# Altium schematic sheet Stepper_motodriver.SchDoc
size A4; SheetNumber: 3; SheetTotal: 22
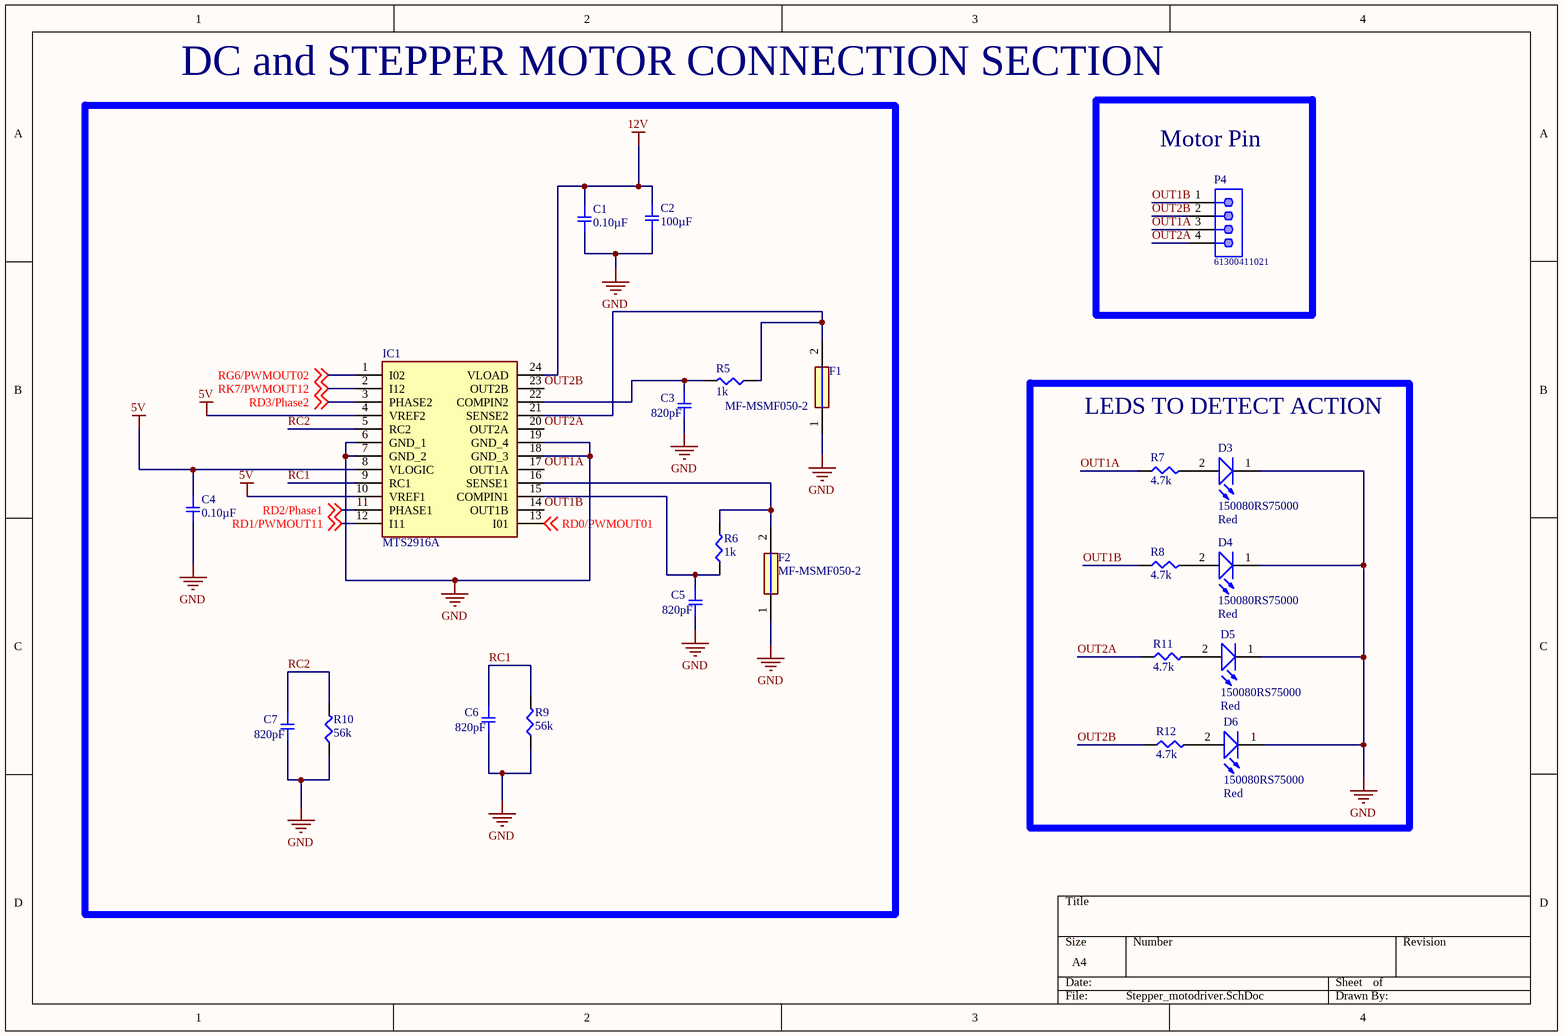
[diagram p0: Stepper_motodriver.SchDoc]

## Parts
C1  0.10µF  [SMD-0805C]
C2  100µF  [SMD-0805C]
C3  820pF  [SMD-0805C]
C4  0.10µF  [SMD-0805C]
C5  820pF  [SMD-0805C]
C6  820pF  [SMD-0805C]
C7  820pF  [SMD-0805C]
D3  150080RS75000  Emitting Color: Red  [WL-SMCW_0805]
D4  150080RS75000  Emitting Color: Red  [WL-SMCW_0805]
D5  150080RS75000  Emitting Color: Red  [WL-SMCW_0805]
D6  150080RS75000  Emitting Color: Red  [WL-SMCW_0805]
F1  MF-MSMF050-2  [FUSC4632X85N]
F2  MF-MSMF050-2  [FUSC4632X85N]
IC1  MTS2916A  [SOIC127P1046X264-24N]
P4  61300411021  [61300411021]
R5  1k  [SMD-0805-RES]
R6  1k  [SMD-0805-RES]
R7  4.7k  [SMD-0805-RES]
R8  4.7k  [SMD-0805-RES]
R9  56k  [SMD-0805-RES]
R10  56k  [SMD-0805-RES]
R11  4.7k  [SMD-0805-RES]
R12  4.7k  [SMD-0805-RES]

## Blocks framed on the sheet
DC and STEPPER MOTOR CONNECTION SECTION: C1-C7 F1 F2 IC1 R5 R6 R9 R10
Motor Pin: P4
LEDS TO DETECT ACTION: D3-D6 R7 R8 R11 R12

## Nets
5V: C4.1 IC1.4(VREF2) IC1.8(VLOGIC) IC1.10(VREF1)
12V: C1.1 C2.1 IC1.24(VLOAD)
GND: C1.2 C2.2 C3.2 C4.2 C5.2 C6.2 C7.2 D3.1(K) D4.1(K) D5.1(K) D6.1(K) F1.1 F2.1 IC1.6(GND_1) IC1.7(GND_2) IC1.18(GND_3) IC1.19(GND_4) R9.1 R10.1
OUT1A: IC1.17(OUT1A) P4.3 R7.1
OUT1B: IC1.14(OUT1B) P4.1 R8.1
OUT2A: IC1.20(OUT2A) P4.4 R11.1
OUT2B: IC1.23(OUT2B) P4.2 R12.1
RC1: C6.1 IC1.9(RC1) R9.2
RC2: C7.1 IC1.5(RC2) R10.2
RD0/PWMOUT01: IC1.13(I01) ; off-sheet RD0/PWMOUT01
RD1/PWMOUT11: IC1.12(I11) ; off-sheet RD1/PWMOUT11
RD2/Phase1: IC1.11(PHASE1) ; off-sheet RD2/Phase1
RD3/Phase2: IC1.3(PHASE2) ; off-sheet RD3/Phase2
RG6/PWMOUT02: IC1.1(I02) ; off-sheet RG6/PWMOUT02
RK7/PWMOUT12: IC1.2(I12) ; off-sheet RK7/PWMOUT12
NetC3_1: C3.1 IC1.22(COMPIN2) R5.2
NetC5_1: C5.1 IC1.15(COMPIN1) R6.1
NetD3_2: D3.2(A) R7.2
NetD4_2: D4.2(A) R8.2
NetD5_2: D5.2(A) R11.2
NetD6_2: D6.2(A) R12.2
NetF1_2: F1.2 IC1.21(SENSE2) R5.1
NetF2_2: F2.2 IC1.16(SENSE1) R6.2

## Library data of the parts
C1 C4 = GCD21BR71H104KA01L: CAP CER 0.1UF 50V X7R 0805; Manufacturer: Murata Electronics North America; Factory Stock: 0; Unit Price (USD): 0.24; Minimum Quantity: 1; Tolerance: ±10%; Datasheets: http://www.murata.com/~/media/webrenewal/support/library/catalog/products/capacitor/mlcc/c03e.ashx; Image: //media.digikey.com/Renders/Murata%20Renders/0805%28GxM6%29.jpg; Digi-Key Part Number: 490-11955-1-ND; Part Number: GCD21BR71H104KA01L; Quantity Available: 157; @ qty: 0; Packaging: Cut Tape (CT); Series: GCD; Part Status: Active; Value: 0.10µF; Voltage: 50V; Temperature Coefficient: X7R; Operating Temperature: -55°C ~ 125°C; Features: -; Ratings: AEC-Q200; Applications: Automotive; Mounting Type: Surface Mount, MLCC; Package / Case: 0805 (2012 Metric); Size / Dimension: 0.079" L x 0.049" W (2.00mm x 1.25mm); Height - Seated (Max): -; Thickness (Max): 0.049" (1.25mm); Lead Spacing: -; Lead Style: -
C2 = GRM21BR60J107ME15L: CAP CER 100UF 6.3V X5R 0805; Manufacturer: Murata Electronics North America; Factory Stock: 0; Unit Price (USD): 2.17; Minimum Quantity: 1; Tolerance: ±20%; Datasheets: http://search.murata.co.jp/Ceramy/image/img/A01X/G101/ENG/GRM21BR60J107ME15-01.pdf; Image: //media.digikey.com/Renders/Murata%20Renders/0805%20(2012%20Metric)%20.85mm.jpg; Digi-Key Part Number: 490-13981-1-ND; Part Number: GRM21BR60J107ME15L; Quantity Available: 4815; @ qty: 0; Packaging: Cut Tape (CT); Series: GRM; Part Status: Active; Value: 100µF; Voltage: 6.3V; Temperature Coefficient: X5R; Operating Temperature: -55°C ~ 85°C; Features: -; Ratings: -; Applications: General Purpose; Mounting Type: Surface Mount, MLCC; Package / Case: 0805 (2012 Metric); Size / Dimension: 0.079" L x 0.049" W (2.00mm x 1.25mm); Height - Seated (Max): -; Thickness (Max): 0.057" (1.45mm); Lead Spacing: -; Lead Style: -
C3 C5-C7 = GRM2165C1H821JA01D: CAP CER 820PF 50V NP0 0805; Manufacturer: Murata Electronics North America; Factory Stock: 0; Unit Price (USD): 0.21; Minimum Quantity: 1; Tolerance: ±5%; Temperature Coefficient: C0G, NP0; Datasheets: http://www.murata.com/~/media/webrenewal/support/library/catalog/products/capacitor/mlcc/c02e.pdf; Image: //media.digikey.com/Renders/Murata%20Renders/0805%20(2012%20Metric)%20.85mm.jpg; Digi-Key Part Number: 490-11551-1-ND; Part Number: GRM2165C1H821JA01D; Quantity Available: 17274; @ qty: 0; Packaging: Cut Tape (CT); Series: GRM; Part Status: Active; Value: 820pF; Voltage: 50V; Operating Temperature: -55°C ~ 125°C; Features: -; Ratings: -; Applications: General Purpose; Mounting Type: Surface Mount, MLCC; Package / Case: 0805 (2012 Metric); Size / Dimension: 0.079" L x 0.049" W (2.00mm x 1.25mm); Height - Seated (Max): -; Thickness (Max): 0.028" (0.70mm); Lead Spacing: -; Lead Style: -
D3-D6 = 150080RS75000: WL-SMCW SMD Mono-color Chip LED Waterclear, size 0805, Red; Forward Voltage: 2 V; Viewing Angle: 140°; Peak Wavelength: 630 nm; Published Date: Jan 2017; Publisher: Wurth Elektronik; ComponentLink1Description: Manufacturer; ComponentLink1URL: http://www.we-online.de; ComponentLink2Description: Datasheet; ComponentLink2URL: http://katalog.we-online.de/led/datasheet/150080RS75000.pdf; Part Number: 150080RS75000; Size: 0805
F1 F2 = MF-MSMF050-2: Fuse; Manufacturer_Name: Bourns; Datasheet Link: https://www.bourns.com/pdfs/mfmsmf.pdf; Manufacturer_Part_Number: MF-MSMF050-2; Mouser Part Number: 652-MF-MSMF050-2; Mouser Price/Stock: https://www.mouser.co.uk/ProductDetail/Bourns/MF-MSMF050-2?qs=t3shhpq1i1DZ7OBD5kLNoA%3D%3D; Arrow Part Number: MF-MSMF050-2; Arrow Price/Stock: https://www.arrow.com/en/products/mf-msmf050-2/bourns?region=europe
IC1 = MTS2916A-HGC1: Integrated Circuit; Manufacturer_Name: Microchip; Datasheet Link: http://ww1.microchip.com/downloads/en/DeviceDoc/22259C.pdf; Height: 2.642mm; Manufacturer_Part_Number: MTS2916A-HGC1; Mouser Part Number: 579-MTS2916A-HGC1; Mouser Price/Stock: https://www.mouser.co.uk/ProductDetail/Microchip-Technology/MTS2916A-HGC1?qs=gdymDg%2FOn%252BFGBMeCto2zTQ%3D%3D; Arrow Part Number: MTS2916A-HGC1; Arrow Price/Stock: https://www.arrow.com/en/products/mts2916a-hgc1/microchip-technology?region=nac
P4 = 61300411021: WR-PHD Pin Header, THT, pitch 2.54mm, Single Row, Angled, 4pin; Pin Number: 4; Gender: Male; Rated Current: 3A; Working Voltage: 250VAC; Withstanding Voltage: 500VAC; Contact Resistance: 20mOhm; ComponentLink1Description: Manufacturer; ComponentLink1URL: http://www.we-online.de; ComponentLink2Description: Datasheet; ComponentLink2URL: https://katalog.we-online.de/em/datasheet/6130xx11021.pdf; Part Number: 61300411021; Published Date: June 2019; Publisher: Wurth Elektronik; Pitch: 2.54mm; Operating Temperature: -40 to +105degC; Mounting Technology: THT; Packaging: Bag; Row Number: Single; Orientation: Angled
R5 R6 = ERJ-6ENF1001V: RES SMD 1K OHM 1% 1/8W 0805; Manufacturer: Panasonic Electronic Components; Factory Stock: 0; Unit Price (USD): 0.00729; @ qty: 1500; Minimum Quantity: 1; Power (Watts): 0.125W, 1/8W; Temperature Coefficient: ±100ppm/°C; Part Number: ERJ-6ENF1001V; Datasheets: http://industrial.panasonic.com/www-cgi/jvcr13pz.cgi?E+PZ+3+AOA0002+ERJ6ENF1001V+7+WW; Image: //media.digikey.com/Renders/Panasonic%20Renders/ERJ-0805%20Pkg.jpg; Digi-Key Part Number: P1.00KCCT-ND; Quantity Available: 12895103; Packaging: Cut Tape (CT); Series: ERJ; Part Status: Active; Value: 1k; Tolerance: ±1%; Composition: Thick Film; Features: Automotive AEC-Q200; Operating Temperature: -55°C ~ 155°C; Package / Case: 0805 (2012 Metric); Supplier Device Package: 0805; Size / Dimension: 0.079" L x 0.049" W (2.00mm x 1.25mm); Height - Seated (Max): 0.028" (0.70mm); Number of Terminations: 2; Failure Rate: -
R7 R8 R11 R12 = ERJ-6GEYJ472V: RES SMD 4.7K OHM 5% 1/8W 0805; Manufacturer: Panasonic Electronic Components; Factory Stock: 0; Unit Price (USD): 0.00496; @ qty: 1500; Minimum Quantity: 1; Power (Watts): 0.125W, 1/8W; Temperature Coefficient: ±200ppm/°C; Part Number: ERJ-6GEYJ472V; Datasheets: http://industrial.panasonic.com/www-cgi/jvcr13pz.cgi?E+PZ+3+AOA0001+ERJ6GEYJ472V+7+WW; Image: //media.digikey.com/Renders/Panasonic%20Renders/ERJ-0805%20Pkg.jpg; Digi-Key Part Number: P4.7KACT-ND; Quantity Available: 392030; Packaging: Cut Tape (CT); Series: ERJ; Part Status: Active; Value: 4.7k; Tolerance: ±5%; Composition: Thick Film; Features: Automotive AEC-Q200; Operating Temperature: -55°C ~ 155°C; Package / Case: 0805 (2012 Metric); Supplier Device Package: 0805; Size / Dimension: 0.079" L x 0.049" W (2.00mm x 1.25mm); Height - Seated (Max): 0.028" (0.70mm); Number of Terminations: 2; Failure Rate: -
R9 R10 = ERJ-6ENF5602V: RES SMD 56K OHM 1% 1/8W 0805; Manufacturer: Panasonic Electronic Components; Factory Stock: 0; Unit Price (USD): 0.00729; @ qty: 1500; Minimum Quantity: 1; Power (Watts): 0.125W, 1/8W; Temperature Coefficient: ±100ppm/°C; Part Number: ERJ-6ENF5602V; Datasheets: http://industrial.panasonic.com/www-cgi/jvcr13pz.cgi?E+PZ+3+AOA0002+ERJ6ENF5602V+7+WW; Image: //media.digikey.com/Renders/Panasonic%20Renders/ERJ-0805%20Pkg.jpg; Digi-Key Part Number: P56.0KCCT-ND; Quantity Available: 45768; Packaging: Cut Tape (CT); Series: ERJ; Part Status: Active; Value: 56k; Tolerance: ±1%; Composition: Thick Film; Features: Automotive AEC-Q200; Operating Temperature: -55°C ~ 155°C; Package / Case: 0805 (2012 Metric); Supplier Device Package: 0805; Size / Dimension: 0.079" L x 0.049" W (2.00mm x 1.25mm); Height - Seated (Max): 0.028" (0.70mm); Number of Terminations: 2; Failure Rate: -